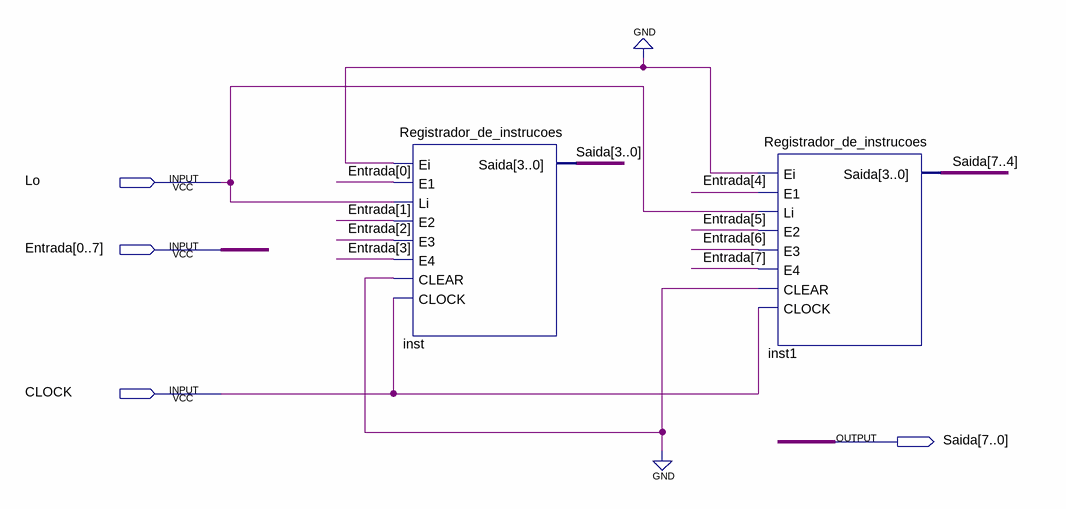
[diagram p0: schematic sheet]
// Quartus schematic Registrador_Saida.bdf as structural Verilog: 2 symbols, 4 pins
module Registrador_Saida (
  input  Lo,
  input  [0:7] Entrada,
  input  CLOCK,
  output [7:0] Saida
);

  Registrador_de_instrucoes inst (
    .Ei(1'b0), .E1(Entrada[0]), .Li(Lo), .E2(Entrada[1]), .E3(Entrada[2]), .E4(Entrada[3]), .CLEAR(1'b0),
    .CLOCK(CLOCK), .Saida(Saida[3:0]));
  Registrador_de_instrucoes inst1 (
    .Ei(1'b0), .E1(Entrada[4]), .Li(Lo), .E2(Entrada[5]), .E3(Entrada[6]), .E4(Entrada[7]), .CLEAR(1'b0),
    .CLOCK(CLOCK), .Saida(Saida[7:4]));
endmodule
